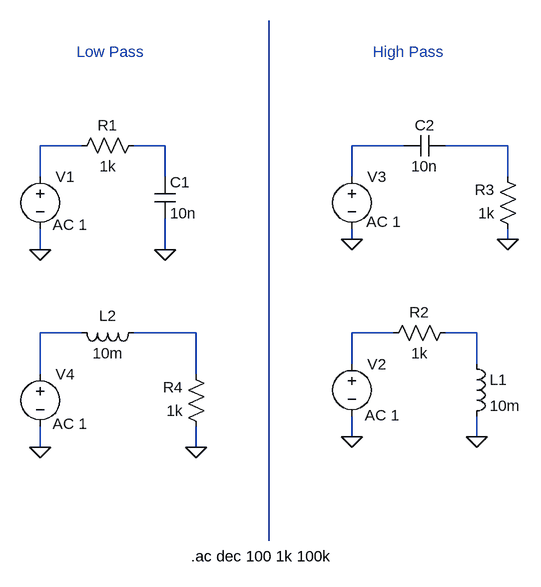
[diagram p0: schematic passive_filters.asc]
passive_filters.asc, the LTspice schematic file:
Version 4
SHEET 1 880 680
WIRE -448 -144 -512 -144
WIRE -320 -144 -368 -144
WIRE 48 -144 -32 -144
WIRE 208 -144 112 -144
WIRE -512 -96 -512 -144
WIRE -320 -96 -320 -144
WIRE -32 -96 -32 -144
WIRE 208 -96 208 -144
WIRE -32 0 -32 -16
WIRE 208 0 208 -16
WIRE -512 16 -512 -16
WIRE -320 16 -320 -32
WIRE -448 144 -512 144
WIRE -272 144 -368 144
WIRE 32 144 -32 144
WIRE 160 144 112 144
WIRE -32 192 -32 144
WIRE 160 192 160 144
WIRE -512 208 -512 144
WIRE -272 208 -272 144
WIRE -32 304 -32 272
WIRE 160 304 160 272
WIRE -512 320 -512 288
WIRE -272 320 -272 288
WIRE -160 464 -160 -336
FLAG -512 16 0
FLAG -320 16 0
FLAG -32 0 0
FLAG 208 0 0
FLAG -32 304 0
FLAG 160 304 0
FLAG -512 320 0
FLAG -272 320 0
SYMBOL voltage -512 -112 R0
WINDOW 123 19 90 Left 2
WINDOW 39 0 0 Left 0
SYMATTR Value2 AC 1
SYMATTR InstName V1
SYMATTR Value ""
SYMBOL voltage -32 176 R0
WINDOW 123 20 95 Left 2
WINDOW 39 0 0 Left 0
SYMATTR Value2 AC 1
SYMATTR InstName V2
SYMATTR Value ""
SYMBOL voltage -32 -112 R0
WINDOW 123 22 85 Left 2
WINDOW 39 0 0 Left 0
SYMATTR Value2 AC 1
SYMATTR InstName V3
SYMATTR Value ""
SYMBOL voltage -512 192 R0
WINDOW 123 19 92 Left 2
WINDOW 39 0 0 Left 0
SYMATTR Value2 AC 1
SYMATTR InstName V4
SYMATTR Value ""
SYMBOL res -352 -160 R90
WINDOW 0 0 56 VBottom 2
WINDOW 3 32 56 VTop 2
SYMATTR InstName R1
SYMATTR Value 1k
SYMBOL res 128 128 R90
WINDOW 0 0 56 VBottom 2
WINDOW 3 32 56 VTop 2
SYMATTR InstName R2
SYMATTR Value 1k
SYMBOL res 224 0 R180
WINDOW 0 36 76 Left 2
WINDOW 3 36 40 Left 2
SYMATTR InstName R3
SYMATTR Value 1k
SYMBOL res -256 304 R180
WINDOW 0 36 76 Left 2
WINDOW 3 36 40 Left 2
SYMATTR InstName R4
SYMATTR Value 1k
SYMBOL cap -336 -96 R0
SYMATTR InstName C1
SYMATTR Value 10n
SYMBOL cap 112 -160 R90
WINDOW 0 0 32 VBottom 2
WINDOW 3 32 32 VTop 2
SYMATTR InstName C2
SYMATTR Value 10n
SYMBOL ind 144 176 R0
SYMATTR InstName L1
SYMATTR Value 10m
SYMBOL ind -352 128 R90
WINDOW 0 5 56 VBottom 2
WINDOW 3 32 56 VTop 2
SYMATTR InstName L2
SYMATTR Value 10m
TEXT -280 488 Left 2 !.ac dec 100 1k 100k
TEXT 0 -288 Left 2 ;High Pass
TEXT -456 -288 Left 2 ;Low Pass

The netlist it stands for:
* passive_filters.asc
V1 N001 0 AC 1
V2 N007 0 AC 1
V3 N003 0 AC 1
V4 N005 0 AC 1
R1 N002 N001 1k
R2 N008 N007 1k
R3 0 N004 1k
R4 0 N006 1k
C1 N002 0 10n
C2 N004 N003 10n
L1 N008 0 10m
L2 N006 N005 10m
.ac dec 100 1k 100k
* High Pass
* Low Pass
.backanno
.end